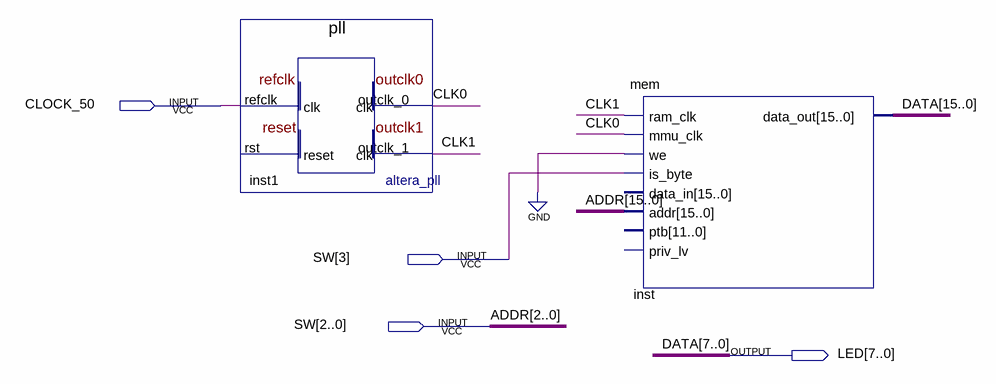
[diagram p0: schematic sheet]
// Quartus schematic scp.bdf as structural Verilog: 2 symbols, 4 pins
module scp (
  input  CLOCK_50,
  input  [3:0] SW,
  output [7:0] LED
);

  wire CLK0, CLK1;
  wire [15:3] ADDR;
  wire [15:8] DATA;

  pll inst1 (.refclk(CLOCK_50), .outclk_0(CLK0), .outclk_1(CLK1));  // open: rst
  mem inst (
    .ram_clk(CLK1), .mmu_clk(CLK0), .we(1'b0), .is_byte(SW[3]), .addr({ADDR, SW[2:0]}), .data_out({DATA, LED}));  // open: data_in, ptb, priv_lv

  // Other names for the same wires on the sheet: ADDR[2:0] = SW[2:0]; DATA[7:0] = LED
endmodule
